# Altium project AV.PrjPcb
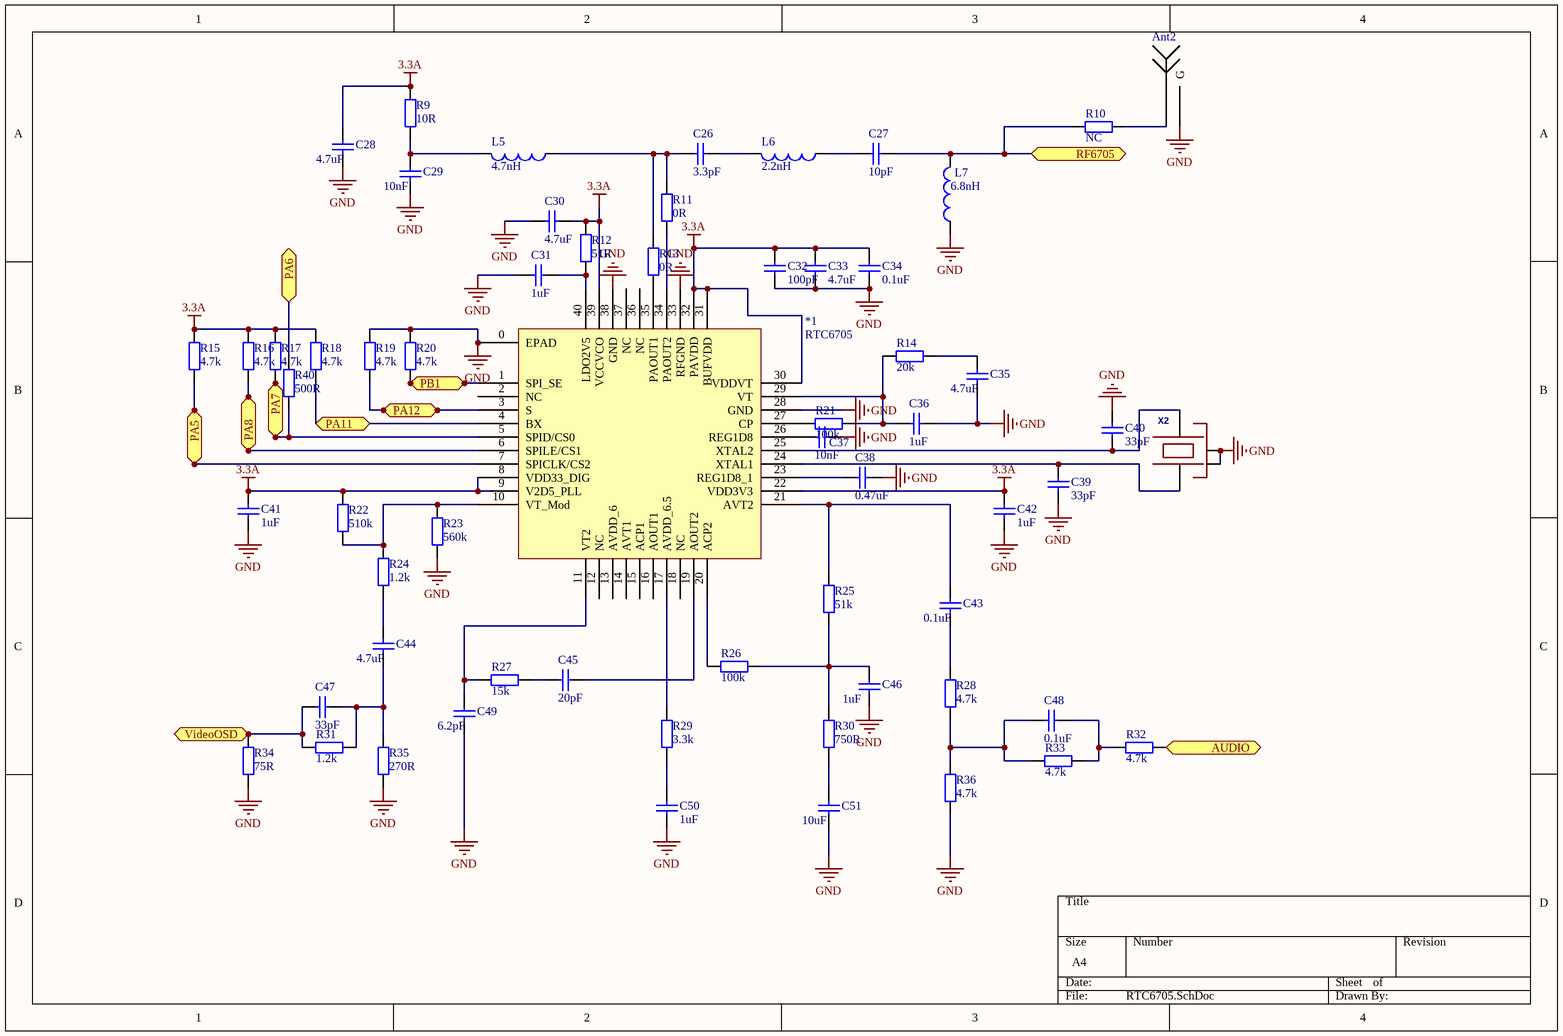
[diagram p0: RTC6705.SchDoc]
5 sheets, 121 parts. Net scope: flat (ports and power ports of the same name join across sheets).
Board file: pcb.PcbDoc
Sheets:
  RTC6705.SchDoc
  PA.SchDoc
  power.SchDoc
  OSD.SchDoc
  MCU.SchDoc

## Sheet RTC6705.SchDoc
size A4

### Parts
*1  RTC6705  [RTC6705]
Ant2  Antenna  [SMA]  (value not drawn)
C26  value 3.3pF  [0402]  (hidden comment: Cap)
C27  value 10pF  [0402]  (hidden comment: Cap)
C28  value 4.7uF  [0603]  (hidden comment: Cap)
C29  value 10nF  [0402]  (hidden comment: Cap)
C30  value 4.7uF  [0402]  (hidden comment: Cap)
C31  value 1uF  [0402]  (hidden comment: Cap)
C32  value 100pF  [0402]  (hidden comment: Cap)
C33  value 4.7uF  [0402]  (hidden comment: Cap)
C34  value 0.1uF  [0402]  (hidden comment: Cap)
C35  value 4.7uF  [0402]  (hidden comment: Cap)
C36  value 1uF  [0402]  (hidden comment: Cap)
C37  value 10nF  [0402]  (hidden comment: Cap)
C38  value 0.47uF  [0402]  (hidden comment: Cap)
C39  value 33pF  [0402]  (hidden comment: Cap)
C40  value 33pF  [0402]  (hidden comment: Cap)
C41  value 1uF  [0402]  (hidden comment: Cap)
C42  value 1uF  [0402]  (hidden comment: Cap)
C43  value 0.1uF  [0402]  (hidden comment: Cap)
C44  value 4.7uF  [0402]  (hidden comment: Cap)
C45  value 20pF  [0402]  (hidden comment: Cap)
C46  value 1uF  [0402]  (hidden comment: Cap)
C47  value 33pF  [0402]  (hidden comment: Cap)
C48  value 0.1uF  [0402]  (hidden comment: Cap)
C49  value 6.2pF  [0402]  (hidden comment: Cap)
C50  value 1uF  [0402]  (hidden comment: Cap)
C51  value 10uF  [0402]  (hidden comment: Cap)
L5  value 4.7nH  [0402]  (hidden comment: Inductor)
L6  value 2.2nH  [0402]  (hidden comment: Inductor)
L7  value 6.8nH  [0402]  (hidden comment: Inductor)
R9  value 10R  [0402]  (hidden comment: Res2)
R10  value NC  [0402]  (hidden comment: Res2)
R11  value 0R  [0402]  (hidden comment: Res2)
R12  value 51R  [0402]  (hidden comment: Res2)
R13  value 0R  [0402]  (hidden comment: Res2)
R14  value 20k  [0402]  (hidden comment: Res2)
R15  value 4.7k  [0402]  (hidden comment: Res2)
R16  value 4.7k  [0402]  (hidden comment: Res2)
R17  value 4.7k  [0402]  (hidden comment: Res2)
R18  value 4.7k  [0402]  (hidden comment: Res2)
R19  value 4.7k  [0402]  (hidden comment: Res2)
R20  value 4.7k  [0402]  (hidden comment: Res2)
R21  value 100k  [0402]  (hidden comment: Res2)
R22  value 510k  [0402]  (hidden comment: Res2)
R23  value 560k  [0402]  (hidden comment: Res2)
R24  value 1.2k  [0402]  (hidden comment: Res2)
R25  value 51k  [0402]  (hidden comment: Res2)
R26  value 100k  [0402]  (hidden comment: Res2)
R27  value 15k  [0402]  (hidden comment: Res2)
R28  value 4.7k  [0402]  (hidden comment: Res2)
R29  value 3.3k  [0402]  (hidden comment: Res2)
R30  value 750R  [0402]  (hidden comment: Res2)
R31  value 1.2k  [0402]  (hidden comment: Res2)
R32  value 4.7k  [0402]  (hidden comment: Res2)
R33  value 4.7k  [0402]  (hidden comment: Res2)
R34  value 75R  [0402]  (hidden comment: Res2)
R35  value 270R  [0402]  (hidden comment: Res2)
R36  value 4.7k  [0402]  (hidden comment: Res2)
R40  value 500R  [0402]  (hidden comment: Res2)
X2  8mhz  [OSCILLATOR-3.2X2.5]  (value not drawn)

### Ports
AUDIO, PA5, PA6, PA7, PA8, PA11, PA12, PB1, RF6705, VideoOSD

### Nets
3.3A: *1.8(VDD33_DIG) *1.9(V2D5_PLL) *1.22(VDD3V3) *1.30(VDDVT) *1.31(BUFVDD) *1.32(PAVDD) *1.39(VCCVCO) C28.2 C30.2 C32.1 C33.1 C34.1 C41.1 C42.1 R9.2 R12.2 R15.2 R16.2 R17.2 R18.2 R22.2
GND: *1.0(EPAD) *1.28(GND) *1.33(RFGND) *1.38(GND) Ant2.GND(G) C28.1 C29.1 C30.1 C31.2 C32.2 C33.2 C34.2 C35.1 C36.1 C37.1 C38.1 C39.2 C40.2 C41.2 C42.2 C46.1 C49.1 C50.2 C51.1 L7.1 R19.2 R20.2 R23.1 R34.1 R35.1 R36.1 X2.2(NC_2) X2.4(NC_4)
Net*1_1: *1.1(SPI_SE) R20.1 ; port PB1
Net*1_3: *1.3(S) R19.1 ; port PA12
Net*1_4: *1.4(BX) R18.1 ; port PA11
Net*1_5: *1.5(SPID/CS0) R17.1 R40.1 ; port PA7
Net*1_6: *1.6(SPILE/CS1) R16.1 ; port PA8
Net*1_7: *1.7(SPICLK/CS2) R15.1 ; port PA5
Net*1_10: *1.10(VT_Mod) R22.1 R23.2 R24.2
Net*1_11: *1.11(VT2) C49.2 R27.2
Net*1_17: *1.17(AVDD_6.5) R29.1
Net*1_19: *1.19(AOUT2) C45.1
Net*1_20: *1.20(ACP2) R26.2
Net*1_21: *1.21(AVT2) C43.2 R25.2
Net*1_23: *1.23(REG1D8_1) C38.2
Net*1_24: *1.24(XTAL1) C39.1 X2.1
Net*1_25: *1.25(XTAL2) C40.1 X2.3
Net*1_26: *1.26(REG1D8) C37.2
Net*1_27: *1.27(CP) R21.2
Net*1_29: *1.29(VT) C36.2 R14.2 R21.1
Net*1_34: *1.34(PAOUT2) R11.1
Net*1_35: *1.35(PAOUT1) R13.1
Net*1_40: *1.40(LDO2V5) C31.1 R12.1
NetAnt2_1: Ant2.1 R10.1
NetAV1_11: R40.2 ; port PA6
NetC7_1: C27.1 L7.2 R10.2 ; port RF6705
NetC26_1: C26.1 L6.2
NetC26_2: C26.2 L5.1 R11.2 R13.2
NetC27_2: C27.2 L6.1
NetC29_2: C29.2 L5.2 R9.1
NetC35_2: C35.2 R14.1
NetC43_1: C43.1 R28.2
NetC44_1: C44.1 C47.1 R31.1 R35.2
NetC44_2: C44.2 R24.1
NetC45_2: C45.2 R27.1
NetC46_2: C46.2 R25.1 R26.1 R30.2
NetC47_2: C47.2 R31.2 R34.2 ; port VideoOSD
NetC48_1: C48.1 R32.2 R33.1
NetC48_2: C48.2 R28.1 R33.2 R36.2
NetC50_1: C50.1 R29.2
NetC51_2: C51.2 R30.1
NetIF*_5: R32.1 ; port AUDIO

Not connected (* = marked no-connect by the designer): *1 2(NC) 12(NC) 13(AVDD_6) 14(AVT1) 15(ACP1) 16(AOUT1) 18(NC) 36(NC) 37(NC)

### Library data of the parts
C26-C51 = Cap: Capacitor; Published: 8-Jun-2000; LatestRevisionDate: 17-Jul-2002; LatestRevisionNote: Re-released for DXP Platform.; PackageReference: RAD-0.3; Publisher: Altium Limited; PackageDescription: Radial Cap, Thru-Hole; 2 Leads; 0.3 in Pin Spacing
L5-L7 = Inductor: Code_IEC: 1005; Published: 8-Jun-2000; LatestRevisionDate: 29-May-2009; LatestRevisionNote: IPC-7351 Footprint Added.; PackageReference: 0402-A; Publisher: Altium Limited; PackageDescription: Chip Inductor; Code_JEITA: 0402
R9-R36 R40 = Res2: Resistor; Published: 8-Jun-2000; LatestRevisionDate: 17-Jul-2002; LatestRevisionNote: Re-released for DXP Platform.; PackageReference: AXIAL-0.4; Publisher: Altium Limited; PackageDescription: Axial Device, Thru-Hole; 2 Leads; 0.4 in Pin Spacing
X2 = OSCILLATOR-3.2X2.5: Crystal Oscillator in 3.2x2.5 SMD

## Sheet PA.SchDoc
size A4
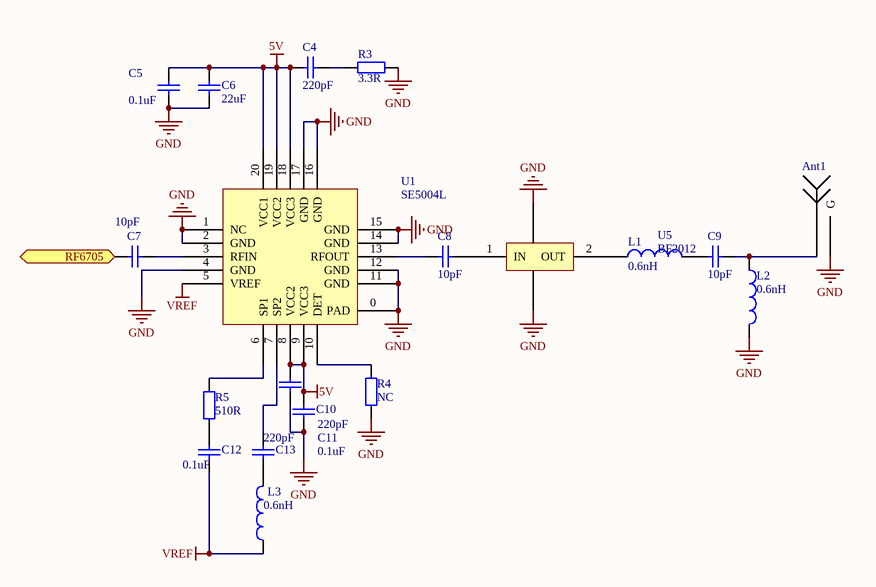
[diagram p1: PA.SchDoc]

### Parts
Ant1  Antenna  [SMA]  (value not drawn)
C4  value 220pF  [0402]  (hidden comment: Cap)
C5  value 0.1uF  [0402]  (hidden comment: Cap)
C6  value 22uF  [0402]  (hidden comment: Cap)
C7  value 10pF  [0402]  (hidden comment: Cap)
C8  value 10pF  [0402]  (hidden comment: Cap)
C9  value 10pF  [0402]  (hidden comment: Cap)
C10  value 0.1uF  [0402]  (hidden comment: Cap)
C11  value 220pF  [0402]  (hidden comment: Cap)
C12  value 0.1uF  [0402]  (hidden comment: Cap)
C13  value 220pF  [0402]  (hidden comment: Cap)
L1  value 0.6nH  [0402]  (hidden comment: Inductor)
L2  value 0.6nH  [0402]  (hidden comment: Inductor)
L3  value 0.6nH  [0402]  (hidden comment: Inductor)
R3  value 3.3R  [0402]  (hidden comment: Res2)
R4  value NC  [0402]  (hidden comment: Res2)
R5  value 510R  [0402]  (hidden comment: Res2)
U1  SE5004L  [SE5004L]
U5  BF2012  [BF2012]

### Ports
RF6705

### Nets
5V: C4.2 C5.2 C6.2 C10.2 C11.2 U1.8(VCC2) U1.9(VCC3) U1.18(VCC3) U1.19(VCC2) U1.20(VCC1)
GND: Ant1.GND(G) C5.1 C6.1 C10.1 C11.1 L2.2 R3.1 R4.1 U1.0(PAD) U1.1(NC) U1.2(GND) U1.4(GND) U1.11(GND) U1.12(GND) U1.14(GND) U1.15(GND) U1.16(GND) U1.17(GND) U5.0(OUT) U5.1(OUT)
VREF: C12.1 L3.1 U1.5(VREF)
NetAnt1_1: Ant1.1 C9.2 L2.1
NetC4_1: C4.1 R3.2
NetC7_1: C7.1 ; port RF6705
NetC7_2: C7.2 U1.3(RFIN)
NetC8_1: C8.1 U1.13(RFOUT)
NetC8_2: C8.2 U5.1(IN)
NetC9_1: C9.1 L1.2
NetC12_2: C12.2 R5.1
NetC13_1: C13.1 L3.2
NetC13_2: C13.2 U1.7(SP2)
NetL1_1: L1.1 U5.2(OUT)
NetR4_2: R4.2 U1.10(DET)
NetR5_2: R5.2 U1.6(SP1)

### Library data of the parts
C4-C13 = Cap: Capacitor; Published: 8-Jun-2000; LatestRevisionDate: 17-Jul-2002; LatestRevisionNote: Re-released for DXP Platform.; PackageReference: RAD-0.3; Publisher: Altium Limited; PackageDescription: Radial Cap, Thru-Hole; 2 Leads; 0.3 in Pin Spacing
L1-L3 = Inductor: Code_IEC: 1005; Published: 8-Jun-2000; LatestRevisionDate: 29-May-2009; LatestRevisionNote: IPC-7351 Footprint Added.; PackageReference: 0402-A; Publisher: Altium Limited; PackageDescription: Chip Inductor; Code_JEITA: 0402
R3-R5 = Res2: Resistor; Published: 8-Jun-2000; LatestRevisionDate: 17-Jul-2002; LatestRevisionNote: Re-released for DXP Platform.; PackageReference: AXIAL-0.4; Publisher: Altium Limited; PackageDescription: Axial Device, Thru-Hole; 2 Leads; 0.4 in Pin Spacing

## Sheet power.SchDoc
size A4
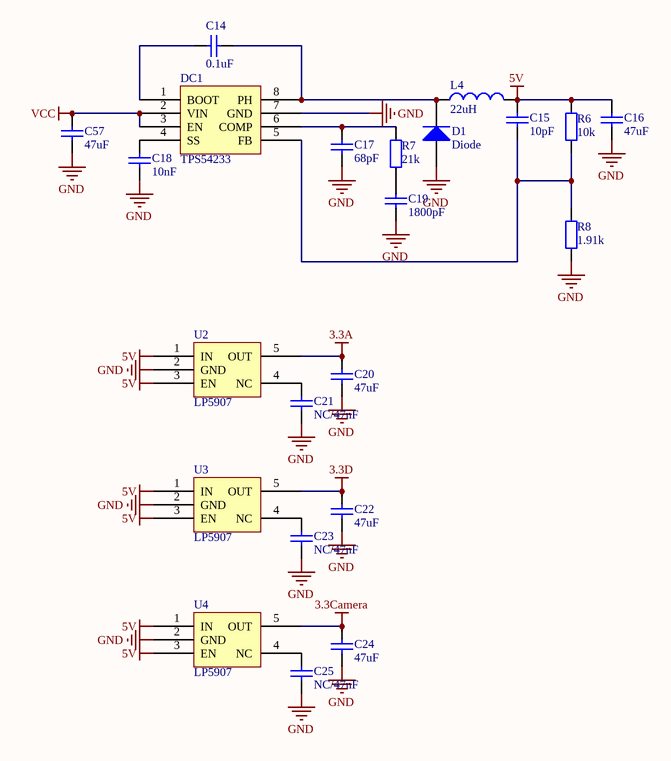
[diagram p2: power.SchDoc]

### Parts
C14  value 0.1uF  [0402]  (hidden comment: Cap)
C15  value 10pF  [0402]  (hidden comment: Cap)
C16  value 47uF  [1210]  (hidden comment: Cap)
C17  value 68pF  [0402]  (hidden comment: Cap)
C18  value 10nF  [0402]  (hidden comment: Cap)
C19  value 1800pF  [0402]  (hidden comment: Cap)
C20  value 47uF  [0805]  (hidden comment: Cap)
C21  value NC/47nF  [0402]  (hidden comment: Cap)
C22  value 47uF  [0805]  (hidden comment: Cap)
C23  value NC/47nF  [0402]  (hidden comment: Cap)
C24  value 47uF  [0805]  (hidden comment: Cap)
C25  value NC/47nF  [0402]  (hidden comment: Cap)
C57  value 47uF  [1210]  (hidden comment: Cap)
D1  Diode  [SMC]
DC1  TPS54233  [SO8]
L4  value 22uH  [L6028/L6045]  (hidden comment: Inductor)
R6  value 10k  [0402]  (hidden comment: Res2)
R7  value 21k  [0402]  (hidden comment: Res2)
R8  value 1.91k  [0402]  (hidden comment: Res2)
U2  LP5907  [SOT23-5]
U3  LP5907  [SOT23-5]
U4  LP5907  [SOT23-5]

### Nets
3.3A: C20.1 U2.5(OUT)
3.3Camera: C24.1 U4.5(OUT)
3.3D: C22.1 U3.5(OUT)
5V: C15.1 C16.1 L4.2 R6.1 U2.1(IN) U2.3(EN) U3.1(IN) U3.3(EN) U4.1(IN) U4.3(EN)
GND: C16.2 C17.2 C18.2 C19.2 C20.2 C21.2 C22.2 C23.2 C24.2 C25.2 C57.2 D1.1(A) DC1.7(GND) R8.2 U2.2(GND) U3.2(GND) U4.2(GND)
VCC: C57.1 DC1.2(VIN) DC1.3(EN)
NetC14_1: C14.1 D1.2(K) DC1.8(PH) L4.1
NetC14_2: C14.2 DC1.1(BOOT)
NetC15_2: C15.2 DC1.5(FB) R6.2 R8.1
NetC17_1: C17.1 DC1.6(COMP) R7.1
NetC18_1: C18.1 DC1.4(SS)
NetC19_1: C19.1 R7.2
NetC21_1: C21.1 U2.4(NC)
NetC23_1: C23.1 U3.4(NC)
NetC25_1: C25.1 U4.4(NC)

### Library data of the parts
C14-C25 C57 = Cap: Capacitor; Published: 8-Jun-2000; LatestRevisionDate: 17-Jul-2002; LatestRevisionNote: Re-released for DXP Platform.; PackageReference: RAD-0.3; Publisher: Altium Limited; PackageDescription: Radial Cap, Thru-Hole; 2 Leads; 0.3 in Pin Spacing
D1 = Diode: Default Diode; Published: 8-Jun-2000; LatestRevisionDate: 17-Jul-2002; LatestRevisionNote: Re-released for DXP Platform.; PackageVersion: Sep-1996; PackageReference: SMC; Publisher: Altium Limited; PackageDescription: DO-214-AB/SMC; 2 C-Bend Leads; Body 7.9 x 5.9 mm, inc. leads (LxW); Code_JEDEC: DO-214-AB
L4 = Inductor: Code_IEC: 1005; Published: 8-Jun-2000; LatestRevisionDate: 29-May-2009; LatestRevisionNote: IPC-7351 Footprint Added.; PackageReference: 0402-A; Publisher: Altium Limited; PackageDescription: Chip Inductor; Code_JEITA: 0402
R6-R8 = Res2: Resistor; Published: 8-Jun-2000; LatestRevisionDate: 17-Jul-2002; LatestRevisionNote: Re-released for DXP Platform.; PackageReference: AXIAL-0.4; Publisher: Altium Limited; PackageDescription: Axial Device, Thru-Hole; 2 Leads; 0.4 in Pin Spacing

## Sheet OSD.SchDoc
size A4
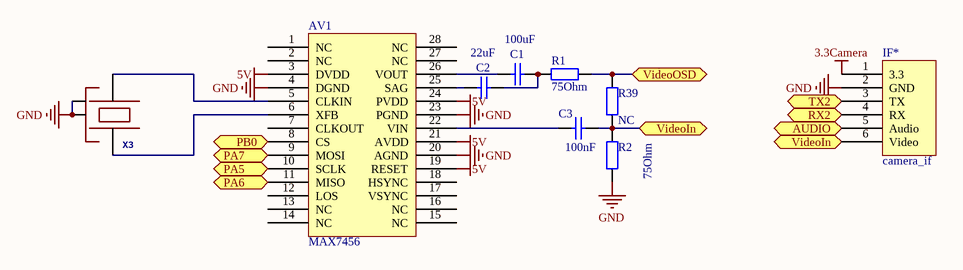
[diagram p3: OSD.SchDoc]

### Parts
AV1  MAX7456  [28TSSOP]
C1  value 100uF  [1210]
C2  value 22uF  [1210]
C3  value 100nF  [0603]
IF*  camera_if  [WFRSM125]
R1  value 75Ohm  [0603]
R2  value 75Ohm  [0603]
R39  value NC  [0603]
X3  8mhz  [OSCILLATOR-3.2X2.5]  (value not drawn)

### Ports
AUDIO, PA5, PA6, PA7, PB0, RX2, TX2, VideoIn, VideoOSD

### Nets
3.3Camera: IF*.1(3.3)
5V: AV1.3(DVDD) AV1.19(RESET) AV1.21(AVDD) AV1.24(PVDD)
GND: AV1.4(DGND) AV1.20(AGND) AV1.23(PGND) IF*.2(GND) R2.1 X3.2(NC_2) X3.4(NC_4)
Net*1_5: AV1.9(MOSI) ; port PA7
Net*1_7: AV1.10(SCLK) ; port PA5
NetAV1_5: AV1.5(CLKIN) X3.1
NetAV1_6: AV1.6(XFB) X3.3
NetAV1_8: AV1.8(CS) ; port PB0
NetAV1_11: AV1.11(MISO) ; port PA6
NetAV1_22: AV1.22(VIN) C3.1
NetAV1_25: AV1.25(SAG) C2.1
NetAV1_26: AV1.26(VOUT) C1.1
NetC1_2: C1.2 C2.2 R1.1
NetC3_2: C3.2 IF*.6(Video) R2.2 R39.1 ; port VideoIn
NetC47_2: R1.2 R39.2 ; port VideoOSD
NetIF*_3: IF*.3(TX) ; port TX2
NetIF*_4: IF*.4(RX) ; port RX2
NetIF*_5: IF*.5(Audio) ; port AUDIO

Not connected (* = marked no-connect by the designer): AV1 1(NC) 2(NC) 7(CLKOUT) 12(LOS) 13(NC) 14(NC) 15(NC) 16(NC) 17(VSYNC) 18(HSYNC) 27(NC) 28(NC)

### Library data of the parts
C1-C3 = Cap Semi: Capacitor (Semiconductor SIM Model); Published: 8-Jun-2000; LatestRevisionDate: 29-May-2009; LatestRevisionNote: IPC-7351 Footprint Added.; PackageReference: C1206; Publisher: Altium Limited; PackageDescription: Chip Capacitor
R1 R2 R39 = Res2: Resistor; Published: 8-Jun-2000; LatestRevisionDate: 17-Jul-2002; LatestRevisionNote: Re-released for DXP Platform.; PackageReference: AXIAL-0.4; Publisher: Altium Limited; PackageDescription: Axial Device, Thru-Hole; 2 Leads; 0.4 in Pin Spacing
X3 = OSCILLATOR-3.2X2.5: Crystal Oscillator in 3.2x2.5 SMD

## Sheet MCU.SchDoc
size A4
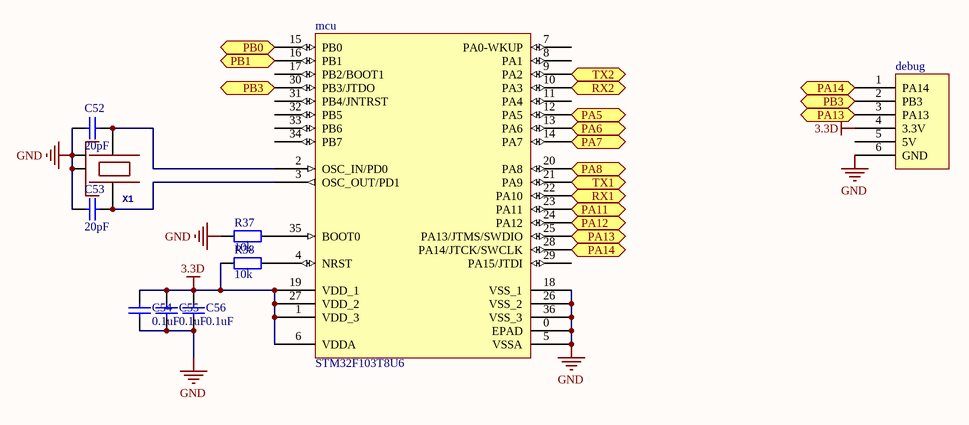
[diagram p4: MCU.SchDoc]

### Parts
C52  value 20pF  [0402]  (hidden comment: Cap)
C53  value 20pF  [0402]  (hidden comment: Cap)
C54  value 0.1uF  [0402]  (hidden comment: Cap)
C55  value 0.1uF  [0402]  (hidden comment: Cap)
C56  value 0.1uF  [0402]  (hidden comment: Cap)
debug  debug  [WFRSM125]  (value not drawn)
mcu  STM32F103T8U6  [VFQN36_V]
R37  value 10k  [0402]  (hidden comment: Res2)
R38  value 10k  [0402]  (hidden comment: Res2)
X1  24.000 KHz 3.2x2.5mm 8-10pf  [OSCILLATOR-3.2X2.5]  (value not drawn)

### Ports
PA5, PA6, PA7, PA8, PA11, PA12, PA13, PA14, PB0, PB1, PB3, RX1, RX2, TX1, TX2

### Nets
3.3D: C54.2 C55.2 C56.2 debug.4(3.3V) mcu.1(VDD_3) mcu.6(VDDA) mcu.19(VDD_1) mcu.27(VDD_2) R38.2
GND: C52.1 C53.1 C54.1 C55.1 C56.1 debug.6(GND) mcu.0(EPAD) mcu.5(VSSA) mcu.18(VSS_1) mcu.26(VSS_2) mcu.36(VSS_3) R37.2 X1.2(NC_2) X1.4(NC_4)
Net*1_1: mcu.16(PB1) ; port PB1
Net*1_3: mcu.24(PA12) ; port PA12
Net*1_4: mcu.23(PA11) ; port PA11
Net*1_5: mcu.14(PA7) ; port PA7
Net*1_6: mcu.20(PA8) ; port PA8
Net*1_7: mcu.12(PA5) ; port PA5
NetAV1_8: mcu.15(PB0) ; port PB0
NetAV1_11: mcu.13(PA6) ; port PA6
NetC52_2: C52.2 mcu.2(OSC_IN/PD0) X1.1
NetC53_2: C53.2 mcu.3(OSC_OUT/PD1) X1.3
Netdebug_1: debug.1(PA14) mcu.28(PA14/JTCK/SWCLK) ; port PA14
Netdebug_2: debug.2(PB3) mcu.30(PB3/JTDO) ; port PB3
Netdebug_3: debug.3(PA13) mcu.25(PA13/JTMS/SWDIO) ; port PA13
NetIF*_3: mcu.9(PA2) ; port TX2
NetIF*_4: mcu.10(PA3) ; port RX2
Netmcu_4: mcu.4(NRST) R38.1
Netmcu_21: mcu.21(PA9) ; port TX1
Netmcu_22: mcu.22(PA10) ; port RX1
Netmcu_35: mcu.35(BOOT0) R37.1

Not connected (* = marked no-connect by the designer): debug 5(5V); mcu 7(PA0-WKUP) 8(PA1) 11(PA4) 17(PB2/BOOT1) 29(PA15/JTDI) 31(PB4/JNTRST) 32(PB5) 33(PB6) 34(PB7)

### Library data of the parts
C52-C56 = Cap: Capacitor; Published: 8-Jun-2000; LatestRevisionDate: 17-Jul-2002; LatestRevisionNote: Re-released for DXP Platform.; PackageReference: RAD-0.3; Publisher: Altium Limited; PackageDescription: Radial Cap, Thru-Hole; 2 Leads; 0.3 in Pin Spacing
mcu = STM32F103T8U6: STM32 ARM-based 32-bit MCU with 64 Kbytes Flash, 36-pin VFQFPN, Industrial Temperature; Published: *; DatasheetVersion: *; PackageVersion: *; PackageReference: *; Publisher: *; PackageDescription: *; ComponentLink1Description: *; ComponentLink1URL: *; ComponentLink2Description: *; ComponentLink2URL: *
R37 R38 = Res2: Resistor; Published: 8-Jun-2000; LatestRevisionDate: 17-Jul-2002; LatestRevisionNote: Re-released for DXP Platform.; PackageReference: AXIAL-0.4; Publisher: Altium Limited; PackageDescription: Axial Device, Thru-Hole; 2 Leads; 0.4 in Pin Spacing
X1 = OSCILLATOR-3.2X2.5: Crystal Oscillator in 3.2x2.5 SMD

## Nets that join several sheets
3.3A: RTC6705 (21 pins), power (C20.1 U2.5)
3.3Camera: power (C24.1 U4.5), OSD (IF*.1)
3.3D: power (C22.1 U3.5), MCU (9 pins)
5V: PA (10 pins), power (10 pins), OSD (AV1.3 AV1.19 AV1.21 AV1.24)
GND: RTC6705 (33 pins), PA (20 pins), power (17 pins), OSD (7 pins), MCU (14 pins)
Net*1_1: RTC6705 (*1.1 R20.1), MCU (mcu.16)
Net*1_3: RTC6705 (*1.3 R19.1), MCU (mcu.24)
Net*1_4: RTC6705 (*1.4 R18.1), MCU (mcu.23)
Net*1_5: RTC6705 (*1.5 R17.1 R40.1), OSD (AV1.9), MCU (mcu.14)
Net*1_6: RTC6705 (*1.6 R16.1), MCU (mcu.20)
Net*1_7: RTC6705 (*1.7 R15.1), OSD (AV1.10), MCU (mcu.12)
NetAV1_8: OSD (AV1.8), MCU (mcu.15)
NetAV1_11: RTC6705 (R40.2), OSD (AV1.11), MCU (mcu.13)
NetC7_1: RTC6705 (C27.1 L7.2 R10.2), PA (C7.1)
NetC47_2: RTC6705 (C47.2 R31.2 R34.2), OSD (R1.2 R39.2)
NetIF*_3: OSD (IF*.3), MCU (mcu.9)
NetIF*_4: OSD (IF*.4), MCU (mcu.10)
NetIF*_5: RTC6705 (R32.1), OSD (IF*.5)